# EAGLE schematic ArmazRelay - RevA1 (EAGLE 7.7.0)
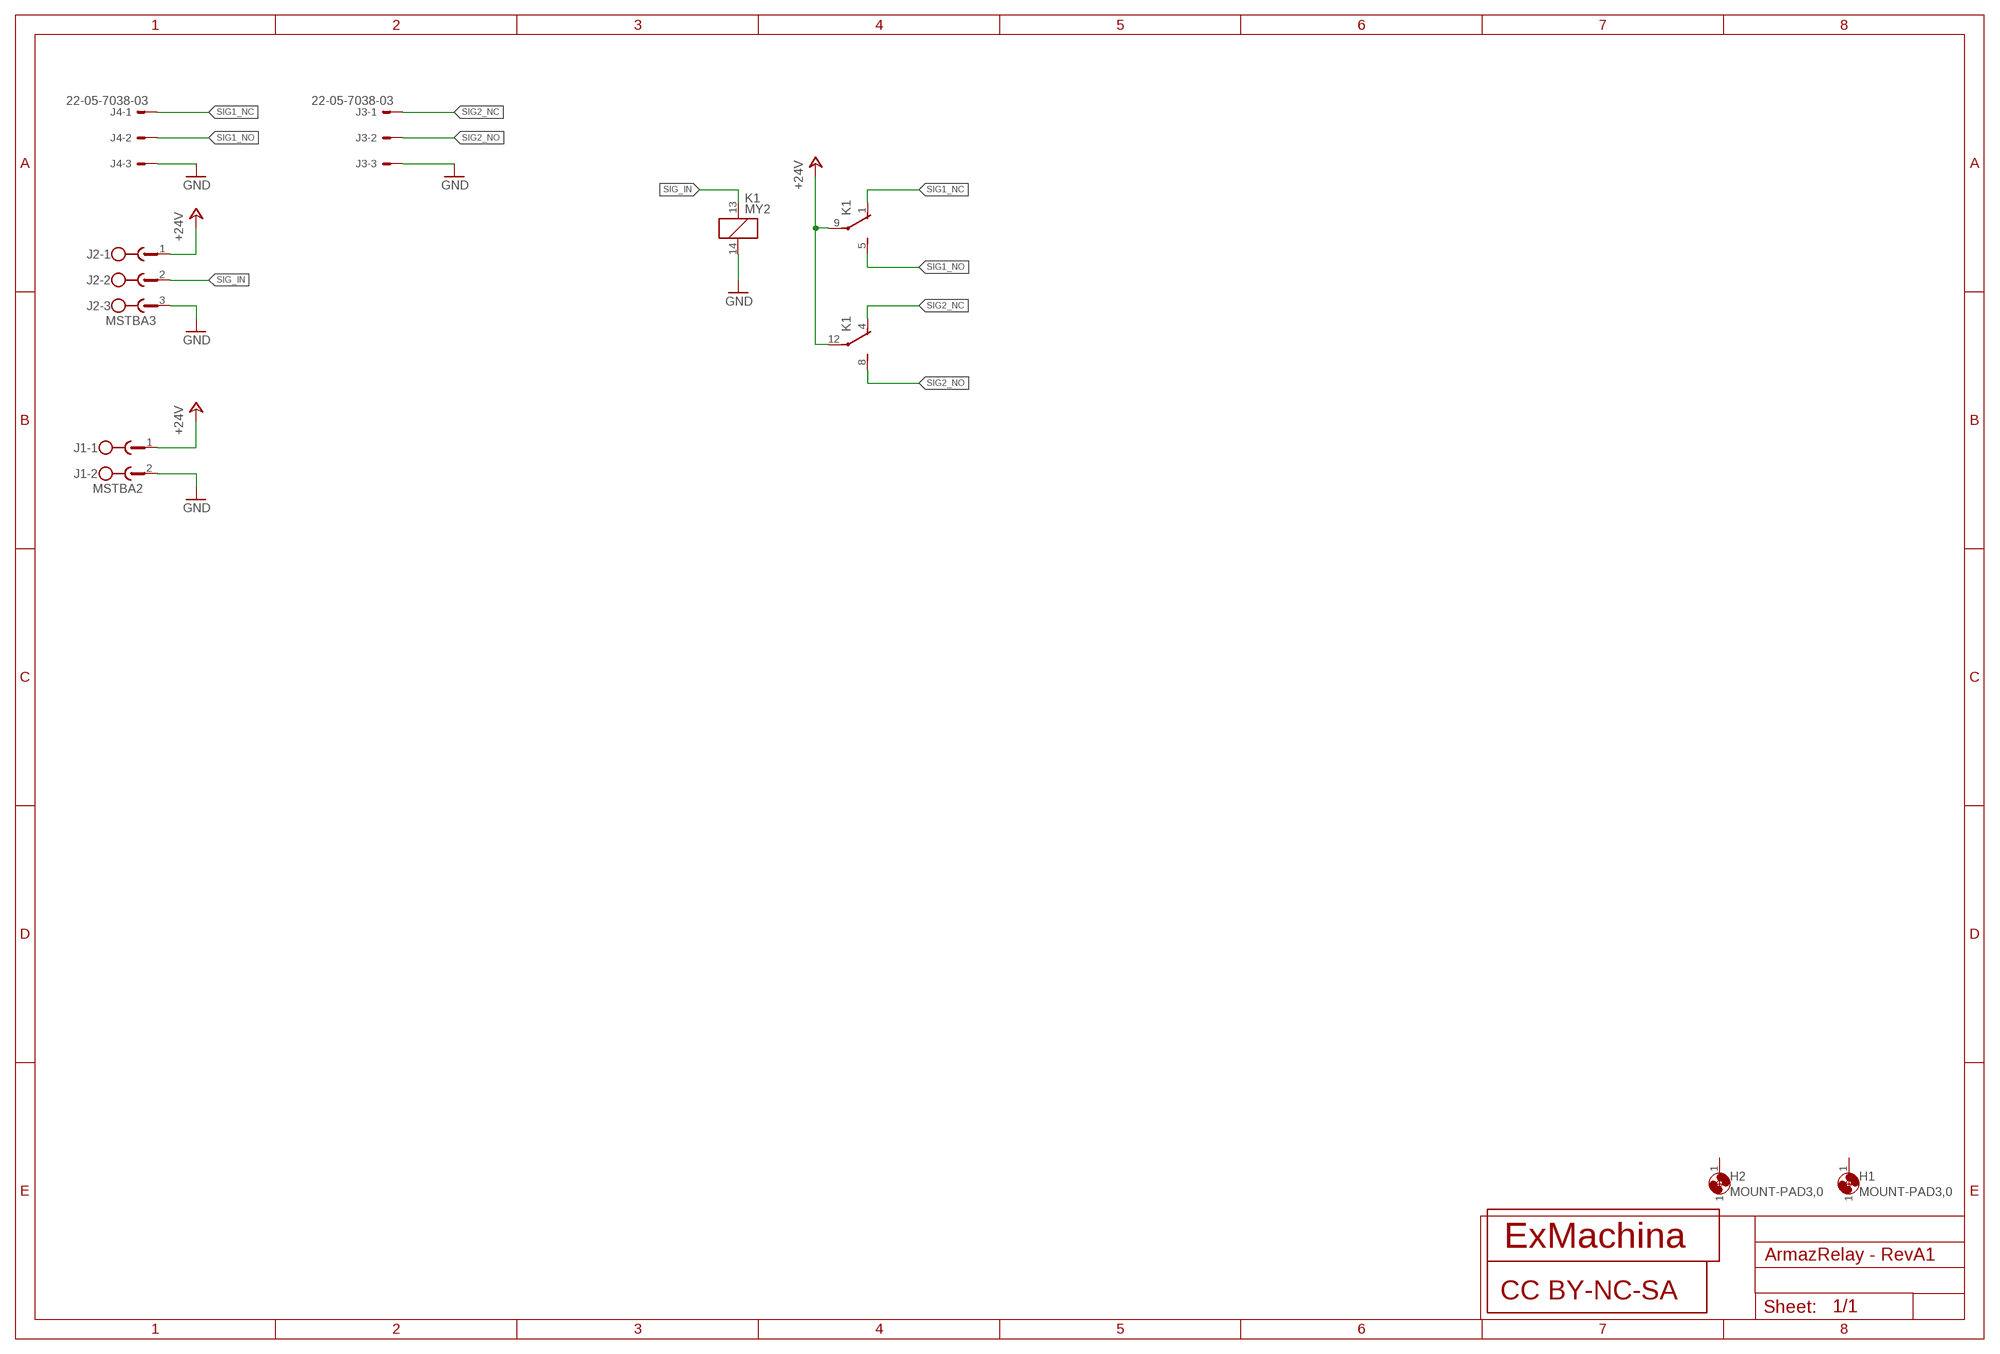
[diagram p0: schematic, sheet 1]

## Parts
CC1  CC-BY-NC-SA  [CC-BY-NC-SA]
H1  MOUNT-PAD3,0  [P3,0]
H2  MOUNT-PAD3,0  [P3,0]
J1  MSTBA2  [MSTBA2]
J2  MSTBA3  [MSTBA3]
J3  22-05-7038-03  [7395-03]
J4  22-05-7038-03  [7395-03]
K1  MY2  [PY08]
T1  EXMACHINA-LOGO-NAME  [EXM-LOGO-BASELINE]

## Nets
+24V: J1.1 J2.1 K1.9(C) K1.12(C)
GND: J1.2 J2.3 J3.3 J4.3 K1.14(COIL2)
SIG1_NC: J4.1 K1.1(NO)
SIG1_NO: J4.2 K1.5(NC)
SIG2_NC: J3.1 K1.4(NO)
SIG2_NO: J3.2 K1.8(NC)
SIG_IN: J2.2 K1.13(COIL1)
Unconnected: H1.1 H2.1

## Library data of the parts
CC1 = cc-by-sa:CC-BY-NC-SA
H1 H2 = holes:MOUNT-PAD: MOUNTING HOLE with drill center marker
J1 = con-phoenix-508:MSTBA2: PHOENIX; MF: FARNELL; MPN: 1757242; OC_FARNELL: 3705171; OC_NEWARK: 71C4161
J2 = con-phoenix-508:MSTBA3: PHOENIX; MF: FARNELL; MPN: 1757255; OC_FARNELL: 3705183; OC_NEWARK: 71C4162
J3 J4 = con-molex:22-?-03: CONNECTOR wire to board 2.54 mm (.1 inch) pitch header; OC_FARNELL: 9731610; OC_NEWARK: unknown
K1 = rel-omron:MY2
T1 = exmachina:EXMACHINA-LOGO

## Net classes
0 default: width 0.813 mm